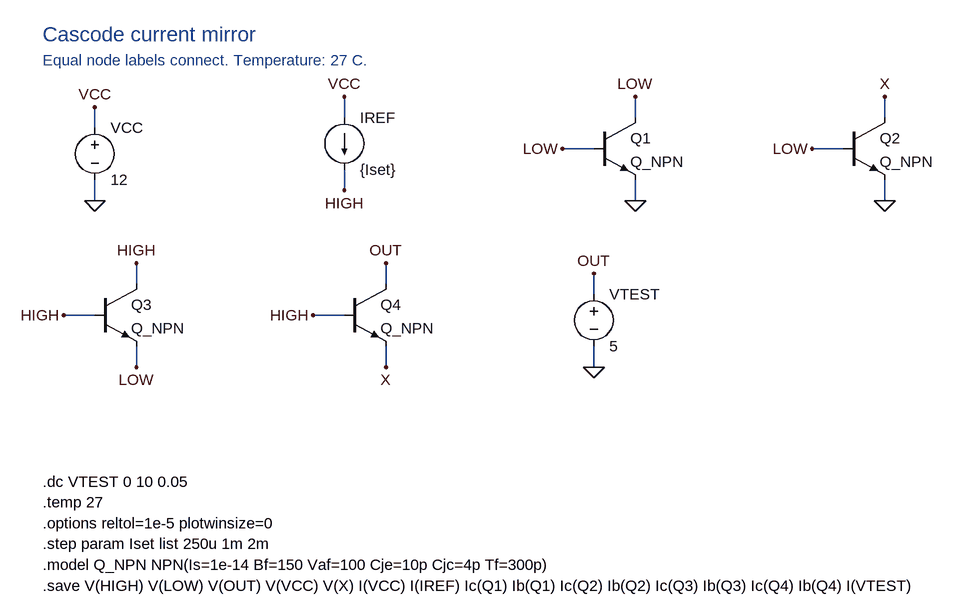
[diagram p0: schematic cascode-current-mirror.asc]
cascode-current-mirror.asc, the LTspice schematic file:
Version 4
SHEET 1 1740 1032
WIRE 144 176 144 144
WIRE 144 256 144 288
WIRE 528 160 528 128
WIRE 528 240 528 272
WIRE 976 160 976 128
WIRE 912 208 864 208
WIRE 976 256 976 288
WIRE 1360 160 1360 128
WIRE 1296 208 1248 208
WIRE 1360 256 1360 288
WIRE 208 416 208 384
WIRE 144 464 96 464
WIRE 208 512 208 544
WIRE 592 416 592 384
WIRE 528 464 480 464
WIRE 592 512 592 544
WIRE 912 432 912 400
WIRE 912 512 912 544
FLAG 144 144 VCC
FLAG 144 288 0
FLAG 528 128 VCC
FLAG 528 272 HIGH
FLAG 976 128 LOW
FLAG 864 208 LOW
FLAG 976 288 0
FLAG 1360 128 X
FLAG 1248 208 LOW
FLAG 1360 288 0
FLAG 208 384 HIGH
FLAG 96 464 HIGH
FLAG 208 544 LOW
FLAG 592 384 OUT
FLAG 480 464 HIGH
FLAG 592 544 X
FLAG 912 400 OUT
FLAG 912 544 0
SYMBOL voltage 144 160 R0
SYMATTR InstName VCC
SYMATTR Value 12
SYMBOL current 528 160 R0
SYMATTR InstName IREF
SYMATTR Value {Iset}
SYMBOL npn 912 160 R0
SYMATTR InstName Q1
SYMATTR Value Q_NPN
SYMBOL npn 1296 160 R0
SYMATTR InstName Q2
SYMATTR Value Q_NPN
SYMBOL npn 144 416 R0
SYMATTR InstName Q3
SYMATTR Value Q_NPN
SYMBOL npn 528 416 R0
SYMATTR InstName Q4
SYMATTR Value Q_NPN
SYMBOL voltage 912 416 R0
SYMATTR InstName VTEST
SYMATTR Value 5
TEXT 64 32 Left 3 ;Cascode current mirror
TEXT 64 72 Left 2 ;Equal node labels connect. Temperature: 27 C.
TEXT 64 720 Left 2 !.dc VTEST 0 10 0.05
TEXT 64 752 Left 2 !.temp 27
TEXT 64 784 Left 2 !.options reltol=1e-5 plotwinsize=0
TEXT 64 816 Left 2 !.step param Iset list 250u 1m 2m
TEXT 64 848 Left 2 !.model Q_NPN NPN(Is=1e-14 Bf=150 Vaf=100 Cje=10p Cjc=4p Tf=300p)
TEXT 64 880 Left 2 !.save V(HIGH) V(LOW) V(OUT) V(VCC) V(X) I(VCC) I(IREF) Ic(Q1) Ib(Q1) Ic(Q2) Ib(Q2) Ic(Q3) Ib(Q3) Ic(Q4) Ib(Q4) I(VTEST)

The netlist it stands for:
* cascode-current-mirror.asc
VCC VCC 0 12
IREF VCC HIGH {Iset}
Q1 LOW LOW 0 0 Q_NPN
Q2 X LOW 0 0 Q_NPN
Q3 HIGH HIGH LOW 0 Q_NPN
Q4 OUT HIGH X 0 Q_NPN
VTEST OUT 0 5
.model NPN NPN
.model PNP PNP
.lib standard.bjt
* Cascode current mirror
* Equal node labels connect. Temperature: 27 C.
.dc VTEST 0 10 0.05
.temp 27
.options reltol=1e-5 plotwinsize=0
.step param Iset list 250u 1m 2m
.model Q_NPN NPN(Is=1e-14 Bf=150 Vaf=100 Cje=10p Cjc=4p Tf=300p)
.save V(HIGH) V(LOW) V(OUT) V(VCC) V(X) I(VCC) I(IREF) Ic(Q1) Ib(Q1) Ic(Q2) Ib(Q2) Ic(Q3) Ib(Q3) Ic(Q4) Ib(Q4) I(VTEST)
.backanno
.end